# Altium schematic sheet Sheet1.SchDoc
size A4; SheetNumber: 1; SheetTotal: 1
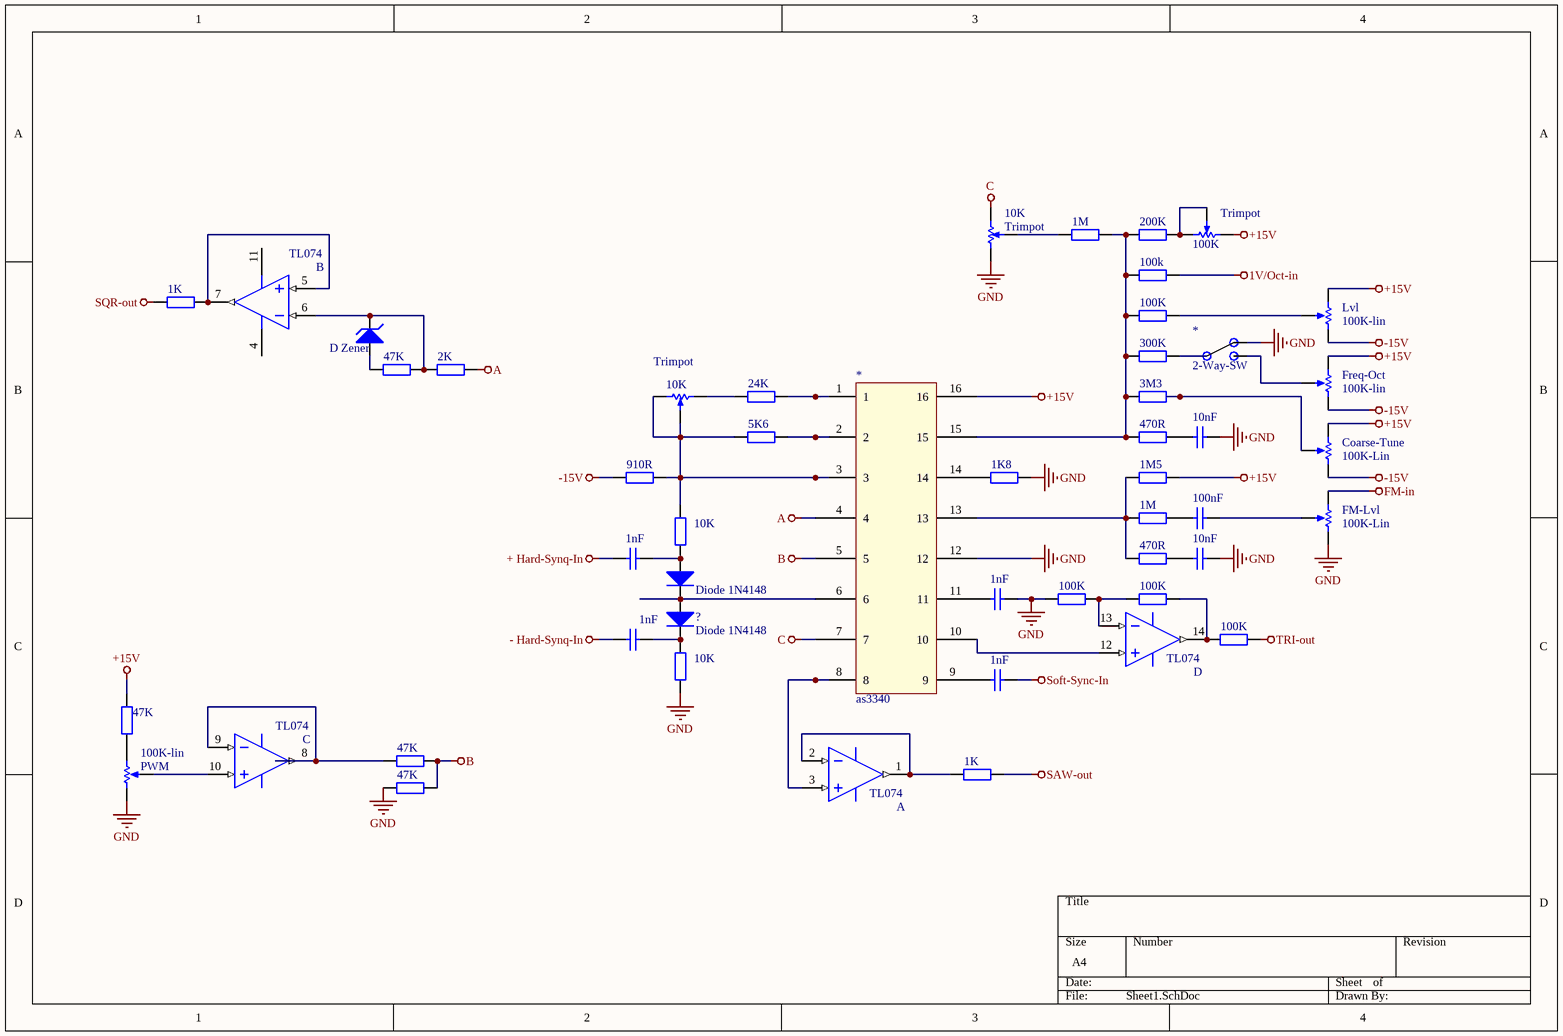
[diagram p0: Sheet1.SchDoc]

## Parts
(Parts that share a designator on the sheet are numbered #1, #2 ... from top to bottom, then left to right.)
1K8  (no value)  [AXIAL-0.4]
1K#1  (no value)  [AXIAL-0.4]
1K#2  (no value)  [AXIAL-0.4]
1M5  (no value)  [AXIAL-0.4]
1M#1  (no value)  [AXIAL-0.4]
1M#2  (no value)  [AXIAL-0.4]
1nF#1  (no value)  [RAD-0.3]
1nF#2  (no value)  [RAD-0.3]
1nF#3  (no value)  [RAD-0.3]
1nF#4  (no value)  [RAD-0.3]
2K  (no value)  [AXIAL-0.4]
3M3  (no value)  [AXIAL-0.4]
5K6  (no value)  [AXIAL-0.4]
10K#1  Trimpot  [POT4MM-2]
10K#2  Trimpot  [POT4MM-2]
10K#3  (no value)  [AXIAL-0.4]
10K#4  (no value)  [AXIAL-0.4]
10nF#1  (no value)  [RAD-0.3]
10nF#2  (no value)  [RAD-0.3]
24K  (no value)  [AXIAL-0.4]
47K#1  (no value)  [AXIAL-0.4]
47K#2  (no value)  [AXIAL-0.4]
47K#3  (no value)  [AXIAL-0.4]
47K#4  (no value)  [AXIAL-0.4]
100K#1  Trimpot  [POT4MM-2]
100k#2  (no value)  [AXIAL-0.4]
100K#3  (no value)  [AXIAL-0.4]
100K#4  (no value)  [AXIAL-0.4]
100K#5  (no value)  [AXIAL-0.4]
100K#6  Res2  [AXIAL-0.4]  (value not drawn)
100K-lin#1  Lvl  [VR5]
100K-lin#2  Freq-Oct  [VR5]
100K-Lin#3  Coarse-Tune  [VR5]
100K-Lin#4  FM-Lvl  [VR5]
100K-lin#5  PWM  [VR5]
100nF  (no value)  [RAD-0.3]
200K  (no value)  [AXIAL-0.4]
300K  (no value)  [AXIAL-0.4]
470R#1  (no value)  [AXIAL-0.4]
470R#2  (no value)  [AXIAL-0.4]
910R  (no value)  [AXIAL-0.4]
*#1  2-Way-SW
*#2  as3340
?#1  TL074  [D0014A_M]  (part B of 4)
?#2  D Zener  [DIODE-0.7]
?#3  Diode 1N4148  [DO-35]
?#4  Diode 1N4148  [DO-35]
?#5  TL074  [D0014A_M]  (part D of 4)
?#6  TL074  [D0014A_M]  (part C of 4)
?#7  TL074  [D0014A_M]  (part A of 4)

## Nets
1V/Oct-in: 100k#2.2
+15V: 1M5.2 47K#2.2 100K#1.CCW(-) 100K-lin#1.1(TOP) 100K-lin#2.1(TOP) 100K-Lin#3.1(TOP) *#2.16
+ Hard-Synq-In: 1nF#1.1
-15V: 100K-lin#1.2(BOT) 100K-lin#2.2(BOT) 100K-Lin#3.2(BOT) 910R.1
- Hard-Synq-In: 1nF#3.1
A: 2K.2 *#2.4
B: 47K#3.2 47K#4.2 *#2.5
C: 10K#1.CW(+) *#2.7
FM-in: 100K-Lin#4.1(TOP)
GND: 1K8.2 1nF#2.2 10K#1.CCW(-) 10K#4.1 10nF#1.2 10nF#2.2 47K#4.1 100K#4.1 100K-Lin#4.2(BOT) 100K-lin#5.1(TOP) *#2.12
SAW-out: 1K#2.2
Soft-Sync-In: 1nF#4.2
SQR-out: 1K#1.1
TRI-out: 100K#6.2
Net1K8_1: 1K8.1 *#2.14
Net1K#1_2: 1K#1.2 ?#1.5(IN2+) ?#1.7(OUT2)
Net1K#2_1: 1K#2.1 ?#7.1(OUT1) ?#7.2(IN1-)
Net1M5_1: 1M5.1 1M#2.1 470R#2.1 *#2.13
Net1M#1_1: 1M#1.1 10K#1.W
Net1M#1_2: 1M#1.2 3M3.1 100k#2.1 100K#3.1 200K.1 300K.1 470R#1.1 *#2.15
Net1M#2_2: 1M#2.2 100nF.1
Net1nF#1_2: 1nF#1.2 10K#3.1 ?#3.1(A)
Net1nF#2_1: 1nF#2.1 *#2.11
Net1nF#3_2: 1nF#3.2 10K#4.2 ?#4.2(K)
Net1nF#4_1: 1nF#4.1 *#2.9
Net2K_1: 2K.1 47K#1.2 ?#1.6(IN2-) ?#2.2(K)
Net3M3_2: 3M3.2 100K-Lin#3.3(TAP)
Net5K6_1: 5K6.1 10K#2.CCW(-) 10K#2.W 10K#3.2 910R.2 *#2.3
Net5K6_2: 5K6.2 *#2.2
Net10K#2_CW: 10K#2.CW(+) 24K.1
Net10nF#1_1: 10nF#1.1 470R#1.2
Net10nF#2_1: 10nF#2.1 470R#2.2
Net24K_2: 24K.2 *#2.1
Net47K#1_1: 47K#1.1 ?#2.1(A)
Net47K#2_1: 47K#2.1 100K-lin#5.2(BOT)
Net47K#3_1: 47K#3.1 ?#6.8(OUT3) ?#6.9(IN3-)
Net100K#1_CW: 100K#1.CW(+) 100K#1.W 200K.2
Net100K#3_2: 100K#3.2 100K-lin#1.3(TAP)
Net100K#4_2: 100K#4.2 100K#5.1 ?#5.13(IN4-)
Net100K#5_2: 100K#5.2 100K#6.1 ?#5.14(OUT4)
Net100K-Lin#4_3: 100K-Lin#4.3(TAP) 100nF.2
Net100K-lin#5_3: 100K-lin#5.3(TAP) ?#6.10(IN3+)
Net*#2_6: *#2.6 ?#3.2(K) ?#4.1(A)
Net*#2_8: *#2.8 ?#7.3(IN1+)
Net*#2_10: *#2.10 ?#5.12(IN4+)

Not connected (* = marked no-connect by the designer): 100K-lin#2 3(TAP); 300K 2; ?#1 4(VCC+) 11(VCC-); ?#5 4(VCC+) 11(VCC-); ?#6 4(VCC+) 11(VCC-); ?#7 4(VCC+) 11(VCC-)

## Library data of the parts
1K8 1K#1 1K#2 1M5 1M#1 1M#2 2K 3M3 5K6 10K#3 10K#4 24K 47K#1-47K#4 100k#2 100K#3 100K#5 200K 300K 470R#1 470R#2 910R = Res2: Resistor; Value: 1K; Published: 8-Jun-2000; LatestRevisionDate: 17-Jul-2002; LatestRevisionNote: Re-released for DXP Platform.; PackageReference: AXIAL-0.4; Publisher: Altium Limited; PackageDescription: Axial Device, Thru-Hole; 2 Leads; 0.4 in Pin Spacing
1nF#1-1nF#4 10nF#1 10nF#2 100nF = Cap: Capacitor; Value: 1nF; Published: 8-Jun-2000; LatestRevisionDate: 17-Jul-2002; LatestRevisionNote: Re-released for DXP Platform.; PackageReference: RAD-0.3; Publisher: Altium Limited; PackageDescription: Radial Cap, Thru-Hole; 2 Leads; 0.3 in Pin Spacing
10K#1 10K#2 100K#1 = RPot SM: Square Trimming Potentiometer; Published: 17-Dec-2003; DatasheetVersion: Oct-2003; PackageReference: POT4MM-2; Publisher: Altium Limited; PackageDescription: Square Trimming Potentiometer; ComponentLink1Description: Manufacturer Link; ComponentLink1URL: http://bourns.com/2/search.html
100K#4 100K#6 = Res2: Resistor; Value: 100K; Published: 8-Jun-2000; LatestRevisionDate: 17-Jul-2002; LatestRevisionNote: Re-released for DXP Platform.; PackageReference: AXIAL-0.4; Publisher: Altium Limited; PackageDescription: Axial Device, Thru-Hole; 2 Leads; 0.4 in Pin Spacing
100K-lin#1 100K-lin#2 100K-Lin#3 100K-Lin#4 100K-lin#5 = RPot: Potentiometer; Sim Note: Enter the Resistance value and the set point into parameter fields.; Set Position: 0.5; Value: 100K; Published: 8-Jun-2000; LatestRevisionDate: 17-Jul-2002; LatestRevisionNote: Re-released for DXP Platform.; PackageReference: VR5; Publisher: Altium Limited; PackageDescription: Variable Resistor, Thru-Hole; 3 Leads
?#1 ?#5-?#7 = CMP-0017-00005-2: Quad Low-Noise JFET-Input General-Purpose Operational Amplifier, 7 to 36 V, 0 to 70 degC, 14-pin SOIC (D14), Green (RoHS & no Sb/Br); PartNumber: TL074CD; Manufacturer: Texas Instruments; Iq per channel(Max)(mA): 2.5; CMRR(Min)(dB): 70; Offset Drift(Typ)(uV/C): 18; Slew Rate(Typ)(V/us): 13; Rating: Military; Number of Channels: 4; Total Supply Voltage(Min)(+5V is 5, +/-5V is 10): 7; Sub Family: General Purpose Amplifier, High Supply Voltage Amplifier (>=30V); IIB(Max)(pA): 200; Total Supply Voltage(Max)(+5V is 5, +/-5V is 10): 36; Vio (25C)(Max)(mV): 10; GBW(Typ)(MHz): 3; ComponentLink1Description: Manufacturer URL; ComponentLink2Description: Datasheet; PackageDescription: 14-Pin Plastic Small Outline, Body 8.65 x 3.90 mm, Pitch 1.27 mm; Mounting Technology: Surface Mount; ComponentLink2URL: http://www.ti.com/lit/ds/symlink/tl074.pdf; Vn at 1kHz(Typ)(nV/rtHz): 18; Eco-Plan: Green (RoHS & no Sb/Br); ComponentLink1URL: http://www.ti.com/; PackageVersion: 4040047-5/M, 06/2011; ComponentLink3Description: Package Specification; DatasheetVersion: SLOS080J; Code_JEDEC: MS-012; PackageReference: D0014A; ComponentLink3URL: http://www.ti.com/lit/ml/mpds177g/mpds177g.pdf
?#2 = D Zener: Zener Diode; Published: 8-Jun-2000; LatestRevisionDate: 17-Jul-2002; LatestRevisionNote: Re-released for DXP Platform.; PackageReference: DIODE-0.7; Publisher: Altium Limited; PackageDescription: Diode, Thru-Hole; 2 Leads; 0.7 in Pin Spacing
?#3 ?#4 = Diode 1N4148: High Conductance Fast Diode; Published: 8-Jun-2000; LatestRevisionDate: 17-Jul-2002; LatestRevisionNote: Re-released for DXP Platform.; DatasheetVersion: 1997; PackageReference: DO-35; Publisher: Altium Limited; PackageDescription: Diode, Axial; Body 3.8 x 1.9 mm (LxDia. max), Lead Dia. 0.53 mm (max); Code_JEDEC: DO-204-AH; ComponentLink1Description: Manufacturer Link; ComponentLink1URL: http://www.fairchildsemi.com/; ComponentLink2Description: Datasheet; ComponentLink2URL: http://www.fairchildsemi.com/ds/1N%2F1N4148.pdf